# Altium schematic sheet IO_Expandor.SchDoc
size A4; Revision: B.2(PCB.SCH)
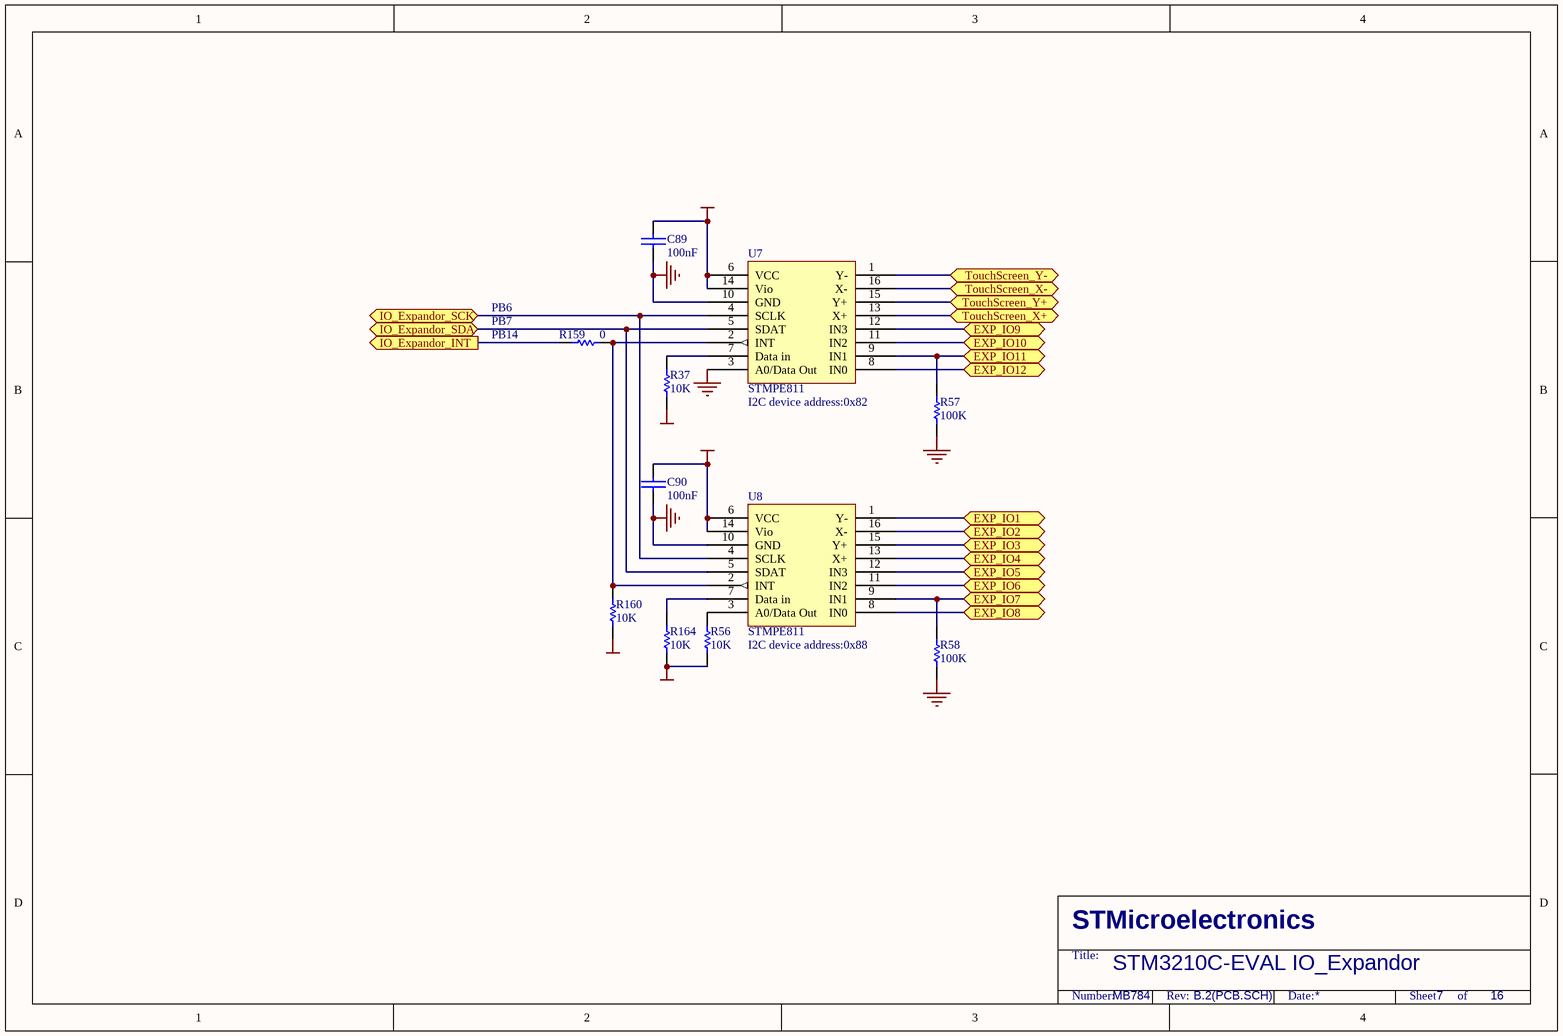
[diagram p0: IO_Expandor.SchDoc]

## Parts
C89  100nF  [0603C]
C90  100nF  [0603C]
R37  10K  [0603R]
R56  10K  [0603R]
R57  100K  [0603R]
R58  100K  [0603R]
R159  0  [0603R]
R160  10K  [0603R]
R164  10K  [0603R]
U7  STMPE811  [QFN16(3X3)]
U8  STMPE811  [QFN16(3X3)]

## Ports
EXP_IO1 (bidir), EXP_IO2 (bidir), EXP_IO3 (bidir), EXP_IO4 (bidir), EXP_IO5 (bidir), EXP_IO6 (bidir), EXP_IO7 (bidir), EXP_IO8 (bidir), EXP_IO9 (bidir), EXP_IO10 (bidir), EXP_IO11 (bidir), EXP_IO12 (bidir), IO_Expandor_INT (out), IO_Expandor_SCK (bidir), IO_Expandor_SDA (bidir), TouchScreen_X+ (bidir), TouchScreen_X- (bidir), TouchScreen_Y+ (bidir), TouchScreen_Y- (bidir)

## Nets
+3V3: C89.1 C90.2 R37.2 R56.2 R160.2 R164.2 U7.6(VCC) U7.14(Vio) U8.6(VCC) U8.14(Vio)
GND: C89.2 C90.1 R57.2 R58.2 U7.3(A0/Data_Out) U7.10(GND) U8.10(GND)
EXP_IO1: U8.1(Y-) ; port EXP_IO1
EXP_IO2: U8.16(X-) ; port EXP_IO2
EXP_IO3: U8.15(Y+) ; port EXP_IO3
EXP_IO4: U8.13(X+) ; port EXP_IO4
EXP_IO5: U8.12(IN3) ; port EXP_IO5
EXP_IO6: U8.11(IN2) ; port EXP_IO6
EXP_IO7: R58.1 U8.9(IN1) ; port EXP_IO7
EXP_IO8: U8.8(IN0) ; port EXP_IO8
EXP_IO9: U7.12(IN3) ; port EXP_IO9
EXP_IO10: U7.11(IN2) ; port EXP_IO10
EXP_IO11: R57.1 U7.9(IN1) ; port EXP_IO11
EXP_IO12: U7.8(IN0) ; port EXP_IO12
IO_Expandor_INT: R159.1 ; port IO_Expandor_INT
IO_Expandor_SCK: U7.4(SCLK) U8.4(SCLK) ; port IO_Expandor_SCK
IO_Expandor_SDA: U7.5(SDAT) U8.5(SDAT) ; port IO_Expandor_SDA
TouchScreen_X+: U7.13(X+) ; port TouchScreen_X+
TouchScreen_X-: U7.16(X-) ; port TouchScreen_X-
TouchScreen_Y+: U7.15(Y+) ; port TouchScreen_Y+
TouchScreen_Y-: U7.1(Y-) ; port TouchScreen_Y-
NetR37_1: R37.1 U7.7(Data_in)
NetR56_1: R56.1 U8.3(A0/Data_Out)
NetR159_2: R159.2 R160.1 U7.2(INT) U8.2(INT)
NetR164_1: R164.1 U8.7(Data_in)

## Notes on the sheet
- PB6
- PB7
- PB14
- (near U7) I2C device address:0x82
- I2C device address:0x88
- STM3210C-EVAL IO_Expandor
- MB784
- 7
- 16
- STMicroelectronics
- Title:
- Number:
- Rev:
- Date:
- Sheet       of

## Library data of the parts
C89 C90 = CAP: Capacitor
R37 R56-R58 R159 R160 R164 = Res1: Resistor; Value: 1K; Published: 8-Jun-2000; Revision: July-2002: Re-released for DXP Platform.; Publisher: Altium Limited